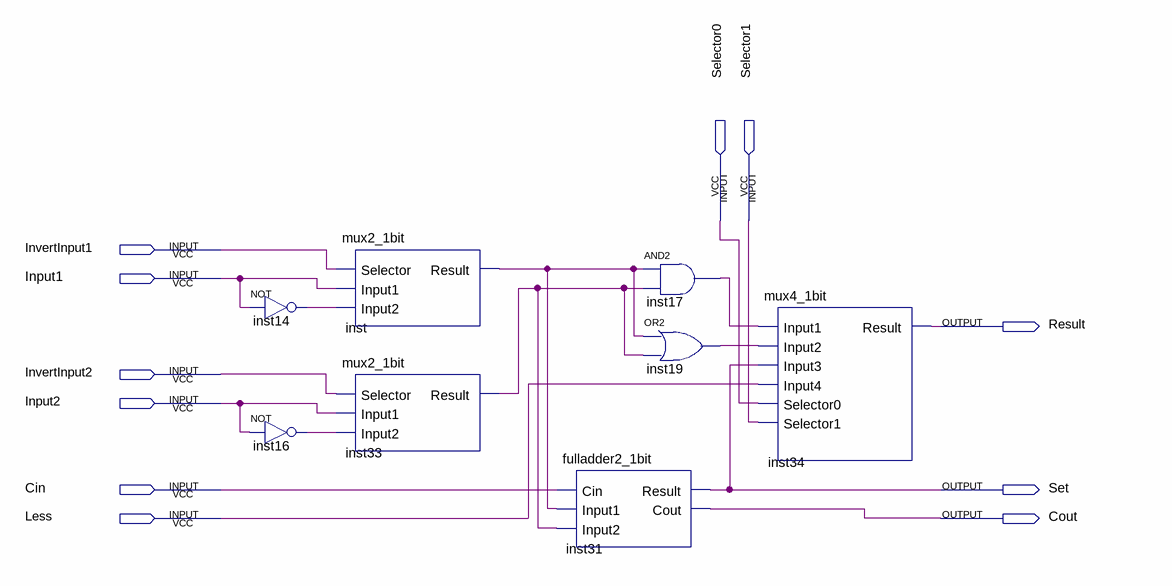
[diagram p0: schematic sheet]
// Quartus schematic mini_alu.bdf as structural Verilog: 8 symbols, 11 pins
module mini_alu (
  input  Selector0,
  input  Selector1,
  input  InvertInput1,
  input  Input1,
  input  InvertInput2,
  input  Input2,
  input  Cin,
  input  Less,
  output Result,
  output Set,
  output Cout
);

  wire inst14_out, inst16_out, inst17_out, inst19_out, inst33_result, inst_result;

  not inst14 (inst14_out, Input1);
  not inst16 (inst16_out, Input2);
  mux2_1bit inst (.Selector(InvertInput1), .Input1(Input1), .Input2(inst14_out), .Result(inst_result));
  mux2_1bit inst33 (.Selector(InvertInput2), .Input1(Input2), .Input2(inst16_out), .Result(inst33_result));
  fulladder2_1bit inst31 (.Cin(Cin), .Input1(inst_result), .Input2(inst33_result), .Result(Set), .Cout(Cout));
  and inst17 (inst17_out, inst_result, inst33_result);
  or inst19 (inst19_out, inst_result, inst33_result);
  mux4_1bit inst34 (
    .Input1(inst17_out), .Input2(inst19_out), .Input3(Set), .Input4(Less), .Selector0(Selector0),
    .Selector1(Selector1), .Result(Result));
endmodule
